# EAGLE design motorBoard (EAGLE 8.5.2)
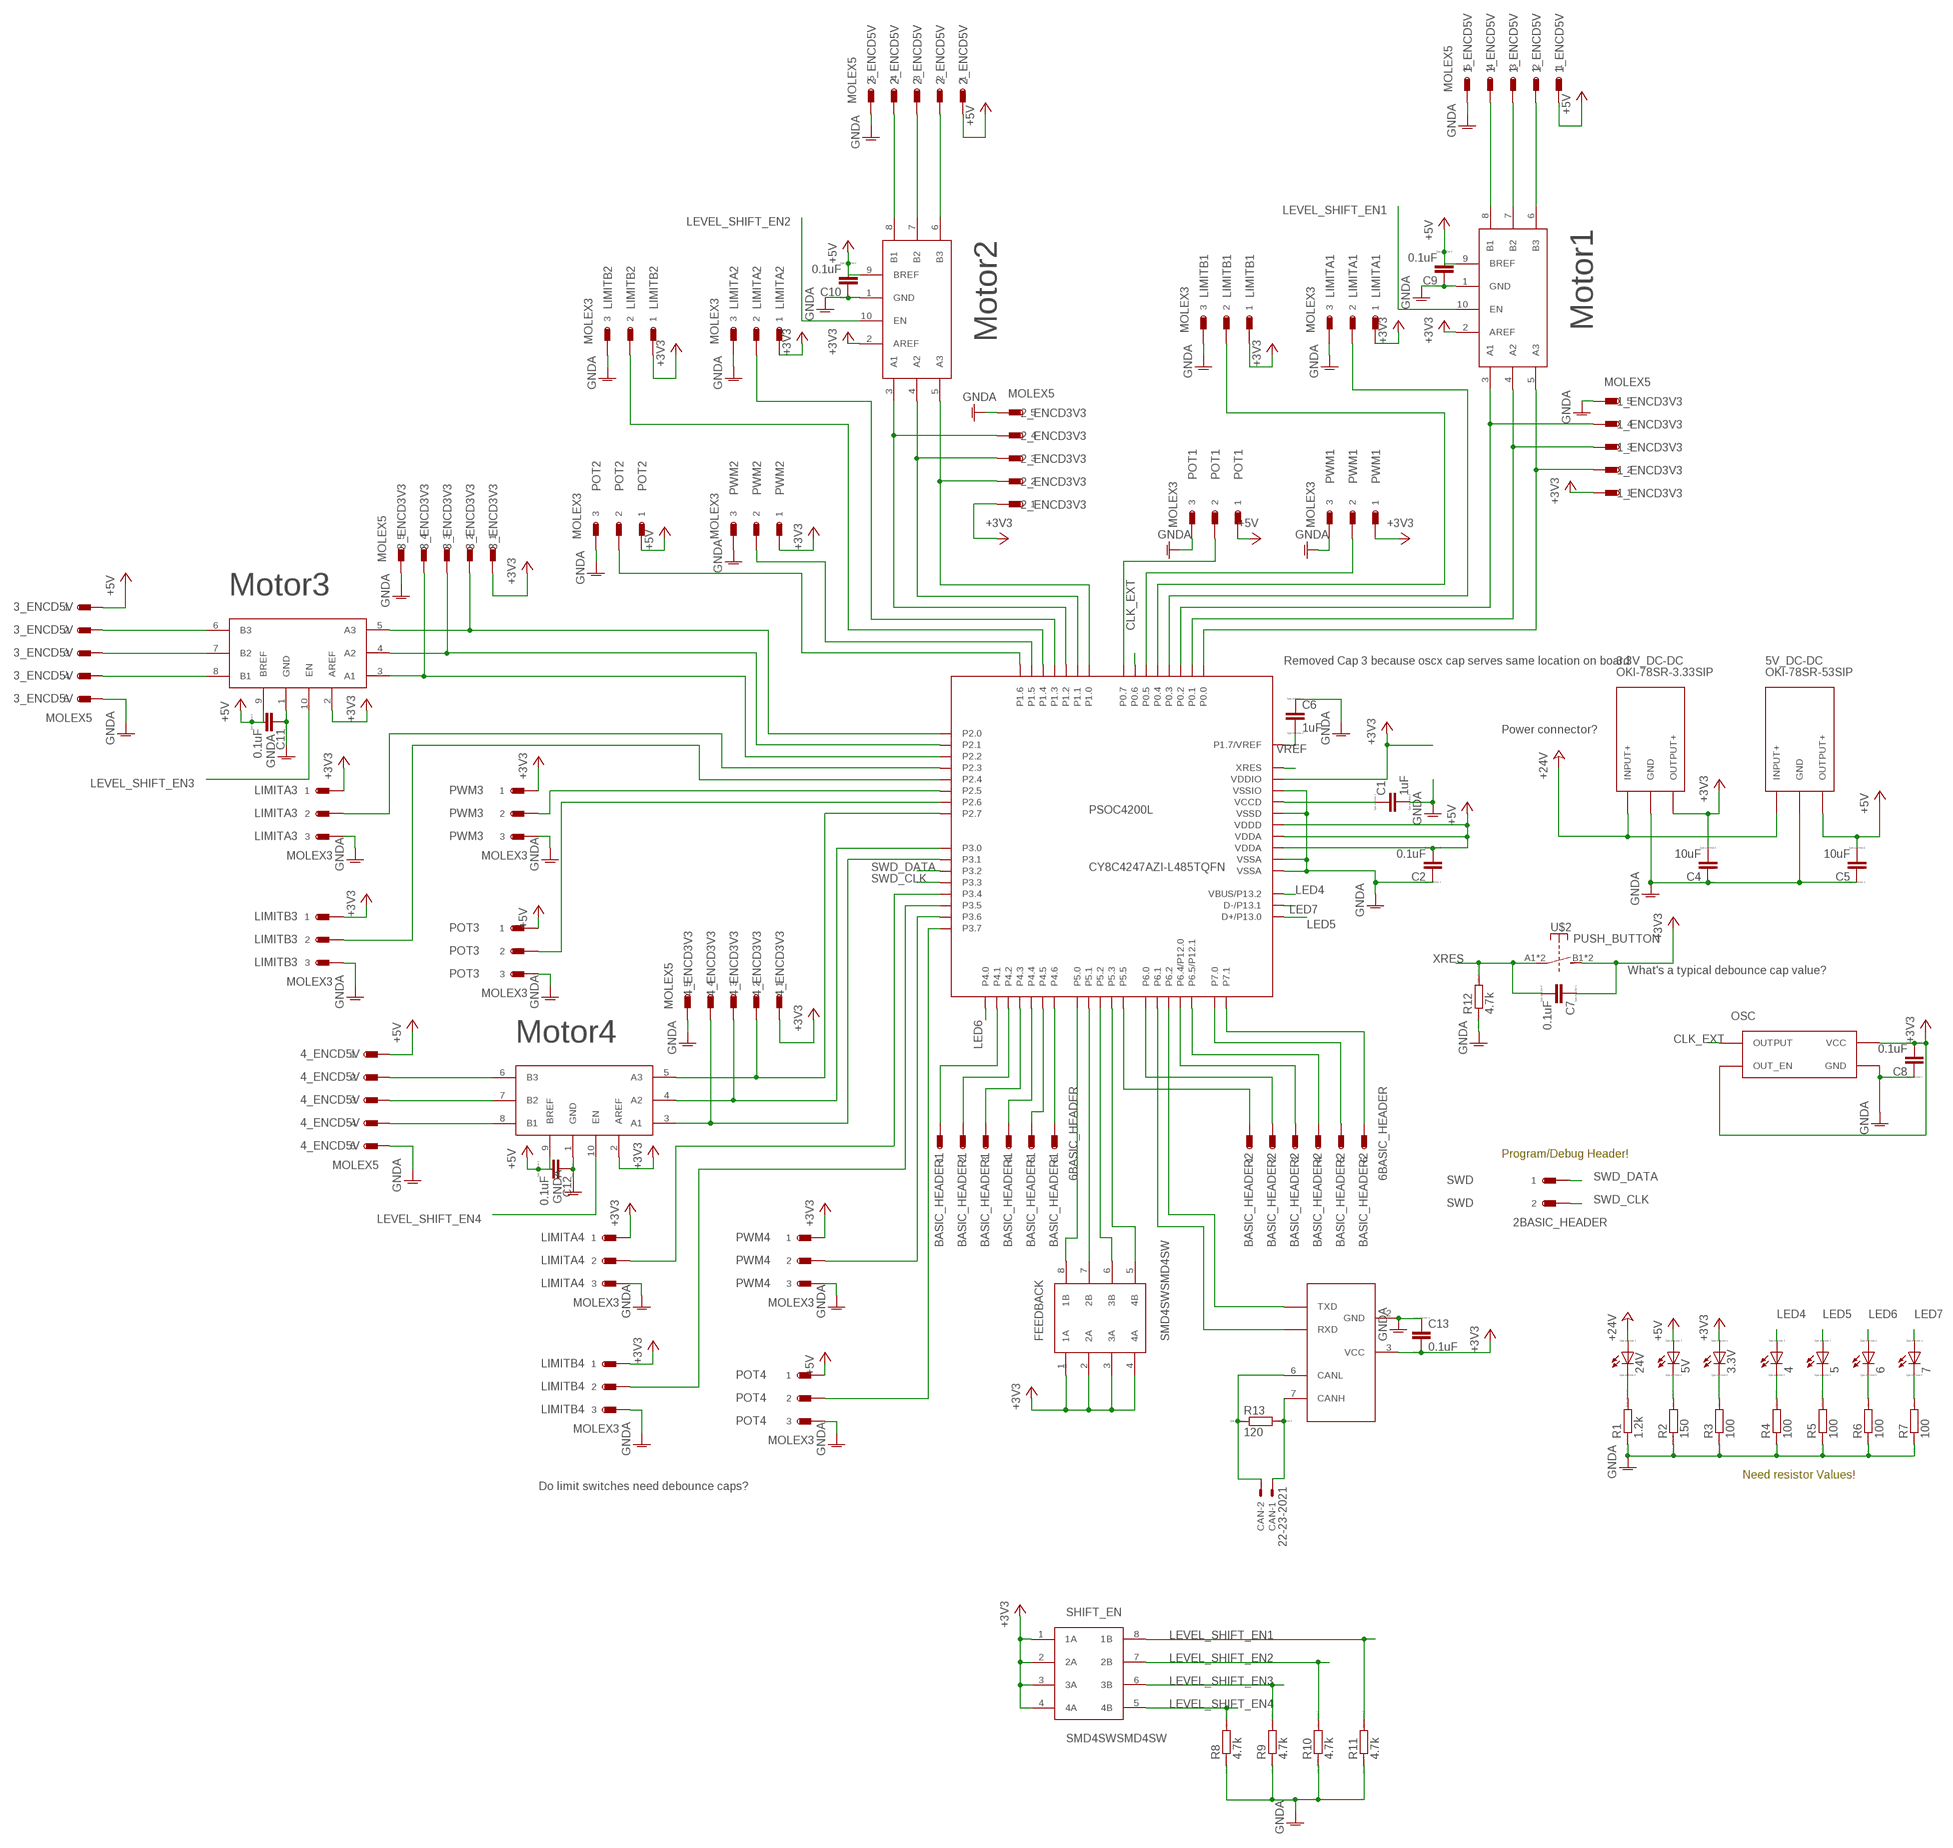
[diagram p0: schematic, sheet 1, part 1 of 2]
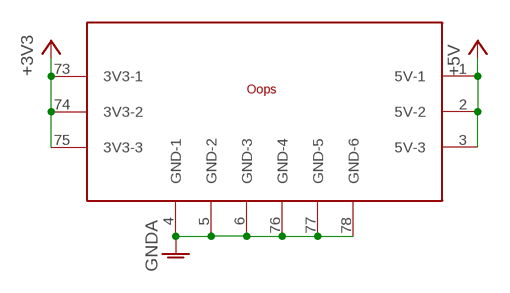
[diagram p1: schematic, sheet 1, part 2 of 2]

## Parts
1_ENCD3V3  MOLEX5  [MOLEX22-23-2051]
1_ENCD5V  MOLEX5  [MOLEX22-23-2051]
2_ENCD3V3  MOLEX5  [MOLEX22-23-2051]
2_ENCD5V  MOLEX5  [MOLEX22-23-2051]
3.3V  LED_E  [LED_1206]
3.3V_DC-DC  OKI-78SR-3.33SIP  [3SIP]
3_ENCD3V3  MOLEX5  [MOLEX22-23-2051]
3_ENCD5V  MOLEX5  [MOLEX22-23-2051]
4  LED_E  [LED_1206]
4_ENCD3V3  MOLEX5  [MOLEX22-23-2051]
4_ENCD5V  MOLEX5  [MOLEX22-23-2051]
5  LED_E  [LED_1206]
5V  LED_E  [LED_1206]
5V_DC-DC  OKI-78SR-53SIP  [3SIP]
6  LED_E  [LED_1206]
7  LED_E  [LED_1206]
24V  LED_E  [LED_1206]
BASIC_HEADER1  6BASIC_HEADER  [6SIP_HEADER]
BASIC_HEADER2  6BASIC_HEADER  [6SIP_HEADER]
C1  1uF  CC1206  [C1206]
C2  0.1uF  CC1206  [C1206]
C4  10uF  CC1206  [C1206]
C5  10uF  CC1206  [C1206]
C6  1uF  CC1206  [C1206]
C7  0.1uF  CC1206  [C1206]
C8  0.1uF  CC1206  [C1206]
C9  0.1uF  CC1206  [C1206]
C10  0.1uF  CC1206  [C1206]
C11  0.1uF  CC1206  [C1206]
C12  0.1uF  CC1206  [C1206]
C13  0.1uF  CC1206  [C1206]
CAN  22-23-2021  [22-23-2021]
FEEDBACK  SMD4SWSMD4SW  [GULL8]
LIMITA1  MOLEX3  [MOLEX22-23-2031]
LIMITA2  MOLEX3  [MOLEX22-23-2031]
LIMITA3  MOLEX3  [MOLEX22-23-2031]
LIMITA4  MOLEX3  [MOLEX22-23-2031]
LIMITB1  MOLEX3  [MOLEX22-23-2031]
LIMITB2  MOLEX3  [MOLEX22-23-2031]
LIMITB3  MOLEX3  [MOLEX22-23-2031]
LIMITB4  MOLEX3  [MOLEX22-23-2031]
OSC  ESPSON_SG-646PCE_CRYSTAL_OSCILLATOREPSON_SG-646PCE_32MHZ  [4SOJ-5.08MM]
POT1  MOLEX3  [MOLEX22-23-2031]
POT2  MOLEX3  [MOLEX22-23-2031]
POT3  MOLEX3  [MOLEX22-23-2031]
POT4  MOLEX3  [MOLEX22-23-2031]
PSOC4200L  CY8C4247AZI-L485TQFN  [TQPF64-10MM]
PWM1  MOLEX3  [MOLEX22-23-2031]
PWM2  MOLEX3  [MOLEX22-23-2031]
PWM3  MOLEX3  [MOLEX22-23-2031]
PWM4  MOLEX3  [MOLEX22-23-2031]
R1  1.2k  RR1206  [R1206]
R2  150  RR1206  [R1206]
R3  100  RR1206  [R1206]
R4  100  RR1206  [R1206]
R5  100  RR1206  [R1206]
R6  100  RR1206  [R1206]
R7  100  RR1206  [R1206]
R8  4.7k  RR1206  [R1206]
R9  4.7k  RR1206  [R1206]
R10  4.7k  RR1206  [R1206]
R11  4.7k  RR1206  [R1206]
R12  4.7k  RR1206  [R1206]
R13  120  RR1206  [R1206]
SHIFT1  LEVEL-SHIFTER_NVT2003DPNVT_2003DP_LEVEL_SHIFTER  [TSSOP10]
SHIFT2  LEVEL-SHIFTER_NVT2003DPNVT_2003DP_LEVEL_SHIFTER  [TSSOP10]
SHIFT3  LEVEL-SHIFTER_NVT2003DPNVT_2003DP_LEVEL_SHIFTER  [TSSOP10]
SHIFT4  LEVEL-SHIFTER_NVT2003DPNVT_2003DP_LEVEL_SHIFTER  [TSSOP10]
SHIFT_EN  SMD4SWSMD4SW  [GULL8]
SWD  2BASIC_HEADER  [2SIP_HEADER]
TCAN  TCAN332TCAN332  [8SOIC3.9]
U$1  OOPS_SPACE  [OOPS_SPACE]
U$2  PUSH_BUTTON  [PUSH_BUTTON]

## Nets
+3V3: 1_ENCD3V3.1 2_ENCD3V3.1 3.3V.A 3.3V_DC-DC.3(OUTPUT+) 3_ENCD3V3.1 4_ENCD3V3.1 C4.2 C7.1 C8.2 C13.2 FEEDBACK.1(1A) FEEDBACK.2(2A) FEEDBACK.3(3A) FEEDBACK.4(4A) LIMITA1.1 LIMITA2.1 LIMITA3.1 LIMITA4.1 LIMITB1.1 LIMITB2.1 LIMITB3.1 LIMITB4.1 OSC.1(OUT_EN) OSC.4(VCC) PSOC4200L.26(VDDIO) PWM1.1 PWM2.1 PWM3.1 PWM4.1 SHIFT1.2(AREF) SHIFT2.2(AREF) SHIFT3.2(AREF) SHIFT4.2(AREF) SHIFT_EN.1(1A) SHIFT_EN.2(2A) SHIFT_EN.3(3A) SHIFT_EN.4(4A) TCAN.3(VCC) U$1.73(3V3-1) U$1.74(3V3-2) U$1.75(3V3-3) U$2.B1(S) U$2.B2(S)
+5V: 1_ENCD5V.1 2_ENCD5V.1 3_ENCD5V.1 4_ENCD5V.1 5V.A 5V_DC-DC.3(OUTPUT+) C2.2 C5.2 C9.2 C10.2 C11.2 C12.2 POT1.1 POT2.1 POT3.1 POT4.1 PSOC4200L.11(VDDA) PSOC4200L.50(VDDD) PSOC4200L.56(VDDA) SHIFT1.9(BREF) SHIFT2.9(BREF) SHIFT3.9(BREF) SHIFT4.9(BREF) U$1.1(5V-1) U$1.2(5V-2) U$1.3(5V-3)
+24V: 3.3V_DC-DC.1(INPUT+) 5V_DC-DC.1(INPUT+) 24V.A
BASIC_HEADER1-1: BASIC_HEADER1.1 PSOC4200L.28(P4.1)
BASIC_HEADER1-2: BASIC_HEADER1.2 PSOC4200L.29(P4.2)
BASIC_HEADER1-3: BASIC_HEADER1.3 PSOC4200L.30(P4.3)
BASIC_HEADER1-4: BASIC_HEADER1.4 PSOC4200L.31(P4.4)
BASIC_HEADER1-5: BASIC_HEADER1.5 PSOC4200L.32(P4.5)
BASIC_HEADER1-6: BASIC_HEADER1.6 PSOC4200L.33(P4.6)
BASIC_HEADER2-1: BASIC_HEADER2.1 PSOC4200L.55(P5.5)
BASIC_HEADER2-2: BASIC_HEADER2.2 PSOC4200L.12(P6.0)
BASIC_HEADER2-3: BASIC_HEADER2.3 PSOC4200L.15(P6.4/P12.0)
BASIC_HEADER2-4: BASIC_HEADER2.4 PSOC4200L.16(P6.5/P12.1)
BASIC_HEADER2-5: BASIC_HEADER2.5 PSOC4200L.37(P7.0)
BASIC_HEADER2-6: BASIC_HEADER2.6 PSOC4200L.38(P7.1)
CANH: CAN.1 R13.2 TCAN.7(CANH)
CANL: CAN.2 R13.1 TCAN.6(CANL)
CANRX: PSOC4200L.13(P6.1) TCAN.4(RXD)
CANTX: PSOC4200L.14(P6.2) TCAN.1(TXD)
CLK_EXT: OSC.3(OUTPUT) PSOC4200L.45(P0.6)
GNDA: 1_ENCD3V3.5 1_ENCD5V.5 2_ENCD3V3.5 2_ENCD5V.5 3.3V_DC-DC.2(GND) 3_ENCD3V3.5 3_ENCD5V.5 4_ENCD3V3.5 4_ENCD5V.5 5V_DC-DC.2(GND) C1.2 C2.1 C4.1 C5.1 C6.1 C8.1 C9.1 C10.1 C11.1 C12.1 C13.1 LIMITA1.3 LIMITA2.3 LIMITA3.3 LIMITA4.3 LIMITB1.3 LIMITB2.3 LIMITB3.3 LIMITB4.3 OSC.2(GND) POT1.3 POT2.3 POT3.3 POT4.3 PSOC4200L.10(VSSA) PSOC4200L.17(VSSIO) PSOC4200L.49(VSSD) PSOC4200L.57(VSSA) PWM1.3 PWM2.3 PWM3.3 PWM4.3 R1.1 R2.1 R3.1 R4.1 R5.1 R6.1 R7.1 R8.1 R9.1 R10.1 R11.1 R12.1 SHIFT1.1(GND) SHIFT2.1(GND) SHIFT3.1(GND) SHIFT4.1(GND) TCAN.2(GND) U$1.4(GND-1) U$1.5(GND-2) U$1.6(GND-3) U$1.76(GND-4) U$1.77(GND-5) U$1.78(GND-6)
LED4: 4.A PSOC4200L.36(VBUS/P13.2)
LED5: 5.A PSOC4200L.34(D+/P13.0)
LED6: 6.A PSOC4200L.27(P4.0)
LED7: 7.A PSOC4200L.35(D-/P13.1)
LEVEL_SHIFT_EN1: R11.2 SHIFT1.10(EN) SHIFT_EN.8(1B)
LEVEL_SHIFT_EN2: R10.2 SHIFT2.10(EN) SHIFT_EN.7(2B)
LEVEL_SHIFT_EN3: R9.2 SHIFT3.10(EN) SHIFT_EN.6(3B)
LEVEL_SHIFT_EN4: R8.2 SHIFT4.10(EN) SHIFT_EN.5(4B)
MOTOR1A1: 1_ENCD3V3.4 PSOC4200L.41(P0.2) SHIFT1.3(A1)
MOTOR1A2: 1_ENCD3V3.3 PSOC4200L.40(P0.1) SHIFT1.4(A2)
MOTOR1A3: 1_ENCD3V3.2 PSOC4200L.39(P0.0) SHIFT1.5(A3)
MOTOR1B1: 1_ENCD5V.4 SHIFT1.8(B1)
MOTOR1B2: 1_ENCD5V.3 SHIFT1.7(B2)
MOTOR1B3: 1_ENCD5V.2 SHIFT1.6(B3)
MOTOR1LIMA: LIMITA1.2 PSOC4200L.42(P0.3)
MOTOR1LIMB: LIMITB1.2 PSOC4200L.43(P0.4)
MOTOR1POT: POT1.2 PSOC4200L.46(P0.7)
MOTOR1PWM: PSOC4200L.44(P0.5) PWM1.2
MOTOR2A1: 2_ENCD3V3.4 PSOC4200L.60(P1.2) SHIFT2.3(A1)
MOTOR2A2: 2_ENCD3V3.3 PSOC4200L.59(P1.1) SHIFT2.4(A2)
MOTOR2A3: 2_ENCD3V3.2 PSOC4200L.58(P1.0) SHIFT2.5(A3)
MOTOR2B1: 2_ENCD5V.4 SHIFT2.8(B1)
MOTOR2B2: 2_ENCD5V.3 SHIFT2.7(B2)
MOTOR2B3: 2_ENCD5V.2 SHIFT2.6(B3)
MOTOR2LIMA: LIMITA2.2 PSOC4200L.61(P1.3)
MOTOR2LIMB: LIMITB2.2 PSOC4200L.62(P1.4)
MOTOR2POT: POT2.2 PSOC4200L.64(P1.6)
MOTOR2PWM: PSOC4200L.63(P1.5) PWM2.2
MOTOR3A1: 3_ENCD3V3.4 PSOC4200L.4(P2.2) SHIFT3.3(A1)
MOTOR3A2: 3_ENCD3V3.3 PSOC4200L.3(P2.1) SHIFT3.4(A2)
MOTOR3A3: 3_ENCD3V3.2 PSOC4200L.2(P2.0) SHIFT3.5(A3)
MOTOR3B1: 3_ENCD5V.4 SHIFT3.8(B1)
MOTOR3B2: 3_ENCD5V.3 SHIFT3.7(B2)
MOTOR3B3: 3_ENCD5V.2 SHIFT3.6(B3)
MOTOR3LIMA: LIMITA3.2 PSOC4200L.5(P2.3)
MOTOR3LIMB: LIMITB3.2 PSOC4200L.6(P2.4)
MOTOR3POT: POT3.2 PSOC4200L.8(P2.6)
MOTOR3PWM: PSOC4200L.7(P2.5) PWM3.2
MOTOR4A1: 4_ENCD3V3.4 PSOC4200L.19(P3.1) SHIFT4.3(A1)
MOTOR4A2: 4_ENCD3V3.3 PSOC4200L.18(P3.0) SHIFT4.4(A2)
MOTOR4A3: 4_ENCD3V3.2 PSOC4200L.9(P2.7) SHIFT4.5(A3)
MOTOR4B1: 4_ENCD5V.4 SHIFT4.8(B1)
MOTOR4B2: 4_ENCD5V.3 SHIFT4.7(B2)
MOTOR4B3: 4_ENCD5V.2 SHIFT4.6(B3)
MOTOR4LIMA: LIMITA4.2 PSOC4200L.22(P3.4)
MOTOR4LIMB: LIMITB4.2 PSOC4200L.23(P3.5)
MOTOR4POT4: POT4.2 PSOC4200L.25(P3.7)
MOTOR4PWM: PSOC4200L.24(P3.6) PWM4.2
N$1: 24V.C R1.2
N$4: 5V.C R2.2
N$7: 3.3V.C R3.2
N$10: 4.C R4.2
N$13: 5.C R5.2
N$17: 6.C R6.2
N$20: 7.C R7.2
SEL_SW1: FEEDBACK.8(1B) PSOC4200L.51(P5.0)
SEL_SW2: FEEDBACK.7(2B) PSOC4200L.52(P5.1)
SEL_SW3: FEEDBACK.6(3B) PSOC4200L.53(P5.2)
SEL_SW4: FEEDBACK.5(4B) PSOC4200L.54(P5.3)
SWD_CLK: PSOC4200L.21(P3.3) SWD.2
SWD_DATA: PSOC4200L.20(P3.2) SWD.1
VCCD: C1.1 PSOC4200L.48(VCCD)
VREF: C6.2 PSOC4200L.1(P1.7/VREF)
XRES: C7.2 PSOC4200L.47(XRES) R12.2 U$2.A1(P) U$2.A2(P)

## Notes on the sheet
- Motor1
- Motor2
- Motor3
- Removed Cap 3 because oscx cap serves same location on board
- Power connector?
- What's a typical debounce cap value?
- Motor4
- Program/Debug Header!
- Need resistor Values!
- Do limit switches need debounce caps?

## Library data of the parts
1_ENCD3V3 1_ENCD5V 2_ENCD3V3 2_ENCD5V 3_ENCD3V3 3_ENCD5V 4_ENCD3V3 4_ENCD5V = HuskyRobotics2017-18:MOLEX5
3.3V 4 5 5V 6 7 24V = eagle-ltspice:LED_E: LED Source: http://www.osram.convergy.de Source: www.luxeon.com Source: www.kingbright.com; SPICEMODEL: NONE; SPICEPREFIX: D; SPICETYPE: diode
3.3V_DC-DC = HuskyRobotics2017-18:OKI-78SR-3.3: Description: This device is the Murata Power Solutions OKI-78SR DC-DC power regulator module, horizontal mount configuration. Created for Husky Robotics Team 2017-2018, part of Arm Motor Board.
5V_DC-DC = HuskyRobotics2017-18:OKI-78SR-5: Description: This device is the Murata Power Solutions OKI-78SR DC-DC power regulator module, horizontal mount configuration. Created for Husky Robotics Team 2017-2018, part of Arm Motor Board.
BASIC_HEADER1 BASIC_HEADER2 = HuskyRobotics2017-18:6BASIC_HEADER
C1 C2 C4-C13 = eagle-ltspice:C: CAPACITOR, European symbol; SPICEMODEL: NONE; SPICEPREFIX: C
CAN = con-molex:22-23-2021: .100" (2.54mm) Center Header - 2 Pin; MF: MOLEX; MPN: 22-23-2021; OC_FARNELL: 1462926; OC_NEWARK: 25C3832
FEEDBACK SHIFT_EN = HuskyRobotics2017-18:SMD4SW
LIMITA1-LIMITA4 LIMITB1-LIMITB4 POT1-POT4 PWM1-PWM4 = HuskyRobotics2017-18:MOLEX3
OSC = HuskyRobotics2017-18:ESPSON_SG-646PCE_CRYSTAL_OSCILLATOR: Description: 32MHz EPSON SG-646PCE crystal oscillator. Source. <https://support.epson.biz/td/api/doc_check.php?dl=brief_SG-636PCE_en.pdf> Created for the husky robotics team 2017-2018, arm motor board.
PSOC4200L = HuskyRobotics2017-18:CY8C4247AZI-L485: Description: This is device is a Cypress PSoC 4200-L series device in a TQFP64 (10mm) package. Created for Husky Robotics team at UW, 2017-2018 team. Contact: Dylan Tomberlin tomberln@uw.edu Know Issues: Name defaults to G$1, need help to change default name Power / IO labels may be incorrect, specifically "VDDIO", which in the online example was listed as just in, and "VSSIO".
R1-R13 = eagle-ltspice:R: RESISTOR, European symbol; SPICEMODEL: NONE; SPICEPREFIX: R
SHIFT1-SHIFT4 = HuskyRobotics2017-18:LEVEL-SHIFTER_NVT2003DP
SWD = HuskyRobotics2017-18:2BASIC_HEADER
TCAN = HuskyRobotics2017-18:TCAN332
U$1 = HuskyRobotics2017-18:OOPS_SPACE
U$2 = HuskyRobotics2017-18:PUSH_BUTTON

## Board
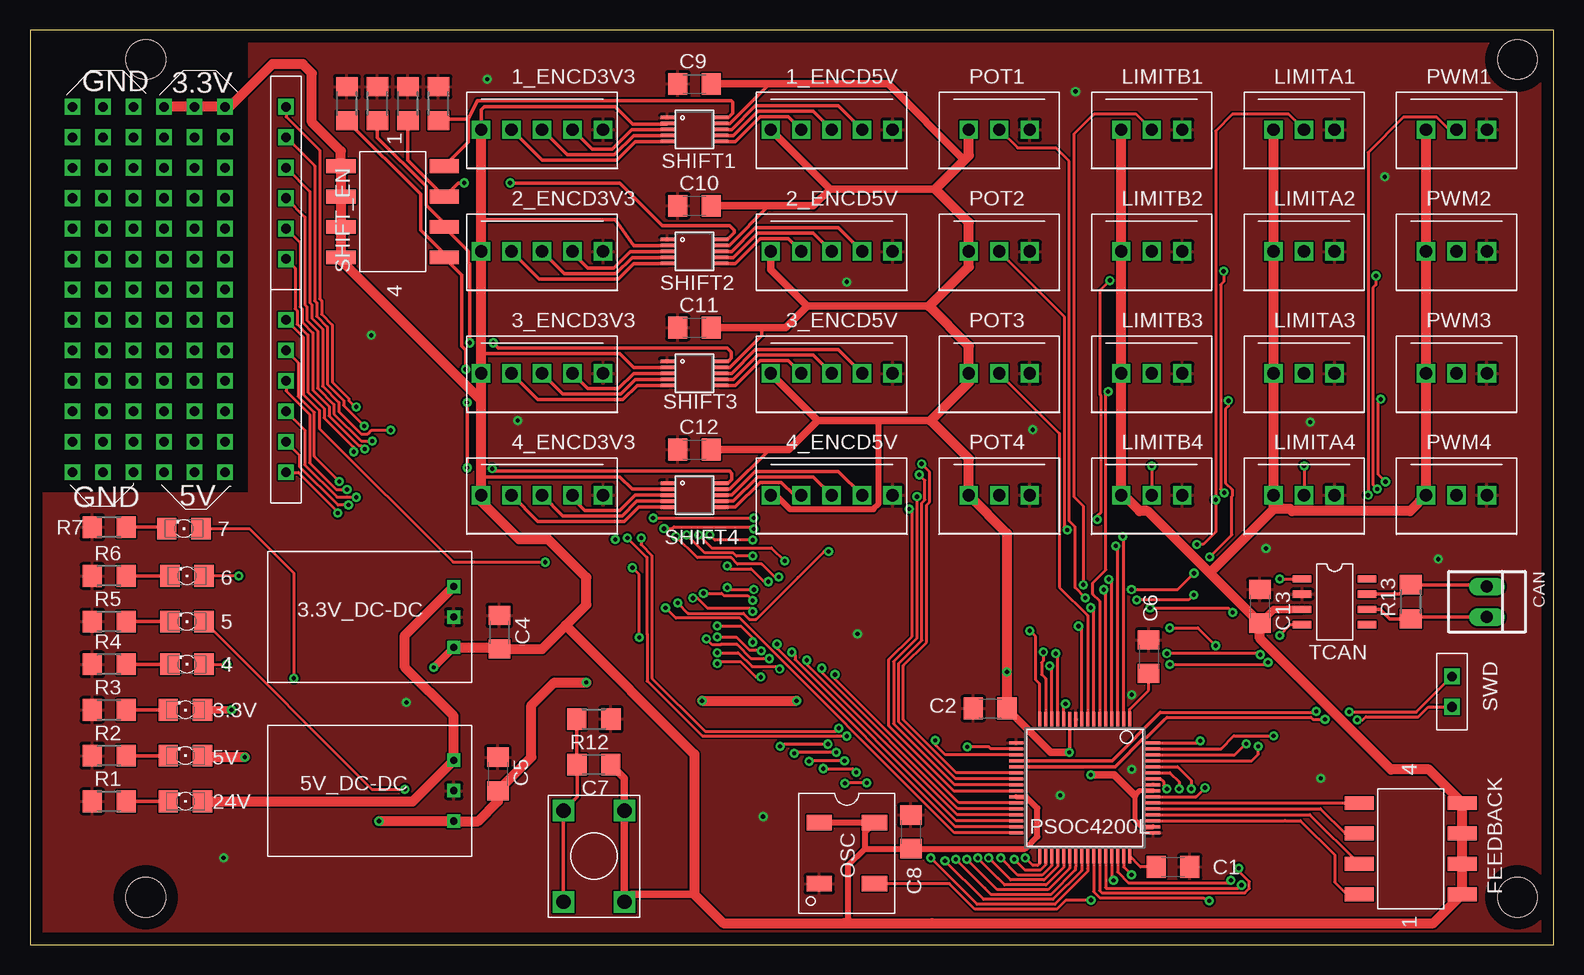
[diagram p2: board, top side]
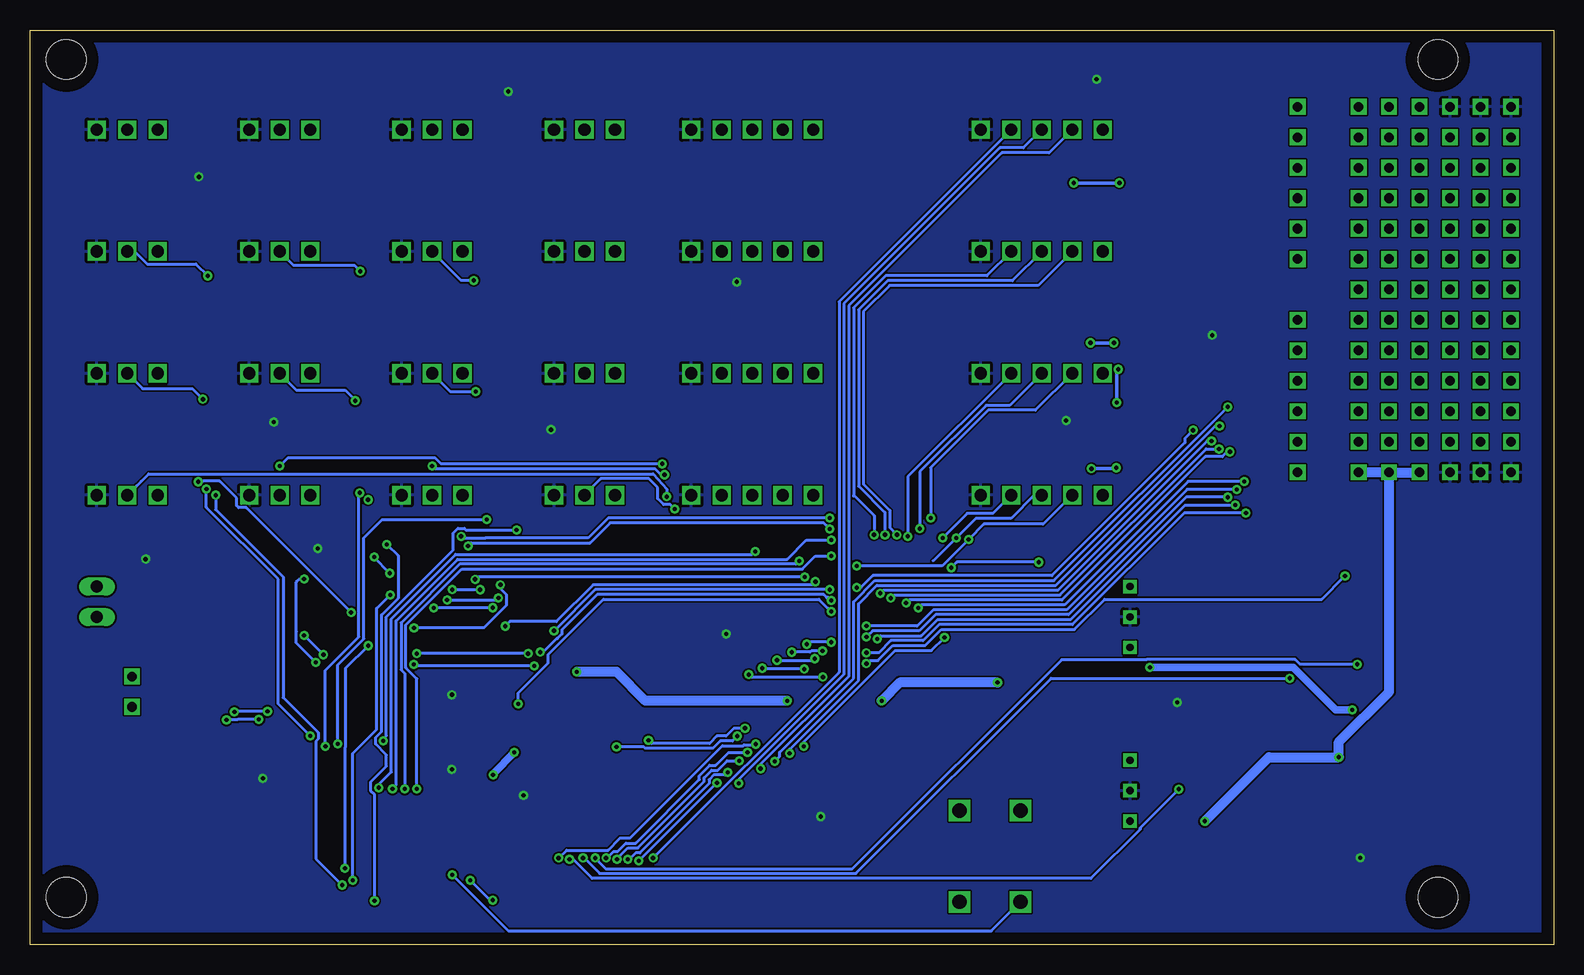
[diagram p3: board, bottom side, seen from below]

Size 126.98 x 76.25 mm. Coordinates in mm from the lower left corner, seen from the top.
Outline: 0,0 126.98,0 126.98,76.25 0,76.25 0,0
Copper layers (1*16): Top 0.035mm / dielectric 1.5mm / Bottom 0.035mm
Design rules "default": minimum track width 6mil, minimum drill 0.35mm, track to track 6mil, track to pad 6mil, pad to pad 6mil, via to via 6mil, smd to smd 6mil, copper to edge 40mil, drill to drill 6mil, minimum pad ring 10mil, minimum via ring 8mil, stop-mask expansion 4mil, vias tented up to drill 0mil, thermal gap 10mil
Holes 3.3 mm at 123.95,73.79 9.65,3.94 9.65,73.79 123.95,3.94

### Footprints (pad centres in the part's own frame; a part is rotated, then mirrored left to right if it is on the bottom)
MOLEX22-23-2051 = drill 1.016 square: 1 -5.08,0; 2 -2.54,0; 3 0,0; 4 2.54,0; 5 5.08,0
LED_1206 = smd 1.6 x 1.803: A -1.422,0; C 1.422,0
3SIP = drill 0.6 square: 1 2.54,0; 2 0,0; 3 -2.54,0
6SIP_HEADER = drill 0.795 square: 1 -6.35,0; 2 -3.81,0; 3 -1.27,0; 4 1.27,0; 5 3.81,0; 6 6.35,0
C1206 = smd 1.6 x 1.8: 1 -1.4,0; 2 1.4,0
22-23-2021 = drill 1 long: 1 -1.27,0; 2 1.27,0
GULL8 = smd 1.13 x 2.44: 1 -3.81,-4.3; 2 -1.27,-4.3; 3 1.27,-4.3; 4 3.81,-4.3; 5 3.81,4.3; 6 1.27,4.3; 7 -1.27,4.3; 8 -3.81,4.3
MOLEX22-23-2031 = drill 1.016 square: 1 -2.54,0; 2 0,0; 3 2.54,0
4SOJ-5.08MM = smd 1.3 x 2.1: 1 -2.54,-2.3; 2 2.54,-2.3; 3 2.54,2.3; 4 -2.54,2.3
TQPF64-10MM = smd 1.2 x 0.25: 1 -5.7,3.75; 2 -5.7,3.25; 3 -5.7,2.75; 4 -5.7,2.25; 5 -5.7,1.75; 6 -5.7,1.25; 7 -5.7,0.75; 8 -5.7,0.25; 9 -5.7,-0.25; 10 -5.7,-0.75; 11 -5.7,-1.25; 12 -5.7,-1.75; 13 -5.7,-2.25; 14 -5.7,-2.75; 15 -5.7,-3.25; 16 -5.7,-3.75; 33 5.7,-3.75; 34 5.7,-3.25; 35 5.7,-2.75; 36 5.7,-2.25; 37 5.7,-1.75; 38 5.7,-1.25; 39 5.7,-0.75; 40 5.7,-0.25; 41 5.7,0.25; 42 5.7,0.75; 43 5.7,1.25; 44 5.7,1.75; 45 5.7,2.25; 46 5.7,2.75; 47 5.7,3.25; 48 5.7,3.75 | smd 0.25 x 1.2: 17 -3.75,-5.7; 18 -3.25,-5.7; 19 -2.75,-5.7; 20 -2.25,-5.7; 21 -1.75,-5.7; 22 -1.25,-5.7; 23 -0.75,-5.7; 24 -0.25,-5.7; 25 0.25,-5.7; 26 0.75,-5.7; 27 1.25,-5.7; 28 1.75,-5.7; 29 2.25,-5.7; 30 2.75,-5.7; 31 3.25,-5.7; 32 3.75,-5.7; 49 3.75,5.7; 50 3.25,5.7; 51 2.75,5.7; 52 2.25,5.7; 53 1.75,5.7; 54 1.25,5.7; 55 0.75,5.7; 56 0.25,5.7; 57 -0.25,5.7; 58 -0.75,5.7; 59 -1.25,5.7; 60 -1.75,5.7; 61 -2.25,5.7; 62 -2.75,5.7; 63 -3.25,5.7; 64 -3.75,5.7
R1206 = smd 1.6 x 1.803: 1 -1.422,0; 2 1.422,0
TSSOP10 = smd 0.3 x 1.1: 1 -1,-2.25; 2 -0.5,-2.25; 3 0,-2.25; 4 0.5,-2.25; 5 1,-2.25; 6 1,2.25; 7 0.5,2.25; 8 0,2.25; 9 -0.5,2.25; 10 -1,2.25
2SIP_HEADER = drill 0.795 square: 1 -1.27,0; 2 1.27,0
8SOIC3.9 = smd 0.6 x 1.55: 1 -1.905,-2.7; 2 -0.635,-2.7; 3 0.635,-2.7; 4 1.905,-2.7; 5 1.905,2.7; 6 0.635,2.7; 7 -0.635,2.7; 8 -1.905,2.7
OOPS_SPACE = drill 0.795 square: 1 -15.24,-6.35; 2 -15.24,-3.81; 3 -15.24,-1.27; 4 -15.24,1.27; 5 -15.24,3.81; 6 -15.24,6.35; 7 -12.7,-1.27; 8 -12.7,-3.81; 9 -12.7,-6.35; 10 -12.7,1.27; 11 -12.7,3.81; 12 -12.7,6.35; 13 -10.16,-1.27; 14 -10.16,-3.81; 15 -10.16,-6.35; 16 -10.16,1.27; 17 -10.16,3.81; 18 -10.16,6.35; 19 -7.62,-1.27; 20 -7.62,-3.81; 21 -7.62,-6.35; 22 -7.62,1.27; 23 -7.62,3.81; 24 -7.62,6.35; 25 -5.08,-1.27; 26 -5.08,-3.81; 27 -5.08,-6.35; 28 -5.08,1.27; 29 -5.08,3.81; 30 -5.08,6.35; 31 -2.54,-1.27; 32 -2.54,-3.81; 33 -2.54,-6.35; 34 -2.54,1.27; 35 -2.54,3.81; 36 -2.54,6.35; 37 0,-1.27; 38 0,-3.81; 39 0,-6.35; 40 0,1.27; 41 0,3.81; 42 0,6.35; 43 2.54,-1.27; 44 2.54,-3.81; 45 2.54,-6.35; 46 2.54,1.27; 47 2.54,3.81; 48 2.54,6.35; 49 5.08,-1.27; 50 5.08,-3.81; 51 5.08,-6.35; 52 5.08,1.27; 53 5.08,3.81; 54 5.08,6.35; 55 7.62,-1.27; 56 7.62,-3.81; 57 7.62,-6.35; 58 7.62,1.27; 59 7.62,3.81; 60 7.62,6.35; 61 10.16,-1.27; 62 10.16,-3.81; 63 10.16,-6.35; 64 10.16,1.27; 65 10.16,3.81; 66 10.16,6.35; 67 12.7,-1.27; 68 12.7,-3.81; 69 12.7,-6.35; 70 12.7,1.27; 71 12.7,3.81; 72 12.7,6.35; 73 15.24,-6.35; 74 15.24,-3.81; 75 15.24,-1.27; 76 15.24,1.27; 77 15.24,3.81; 78 15.24,6.35
PUSH_BUTTON = drill 1.191 square: A1 -3.81,2.54; A2 3.81,2.54; B1 -3.81,-2.54; B2 3.81,-2.54

### Placement (x,y rotation side)
1_ENCD3V3  42.67,67.94 0 top
1_ENCD5V  66.8,67.94 0 top
2_ENCD3V3  42.67,57.78 0 top
2_ENCD5V  66.8,57.78 0 top
3.3V  12.95,19.56 180 top
3.3V_DC-DC  35.31,27.3 90 top
3_ENCD3V3  42.67,47.62 0 top
3_ENCD5V  66.8,47.62 0 top
4  13.08,23.37 180 top
4_ENCD3V3  42.67,37.47 0 top
4_ENCD5V  66.8,37.47 0 top
5  13.08,26.92 180 top
5V  12.95,15.75 180 top
5V_DC-DC  35.31,12.83 90 top
6  13.08,30.73 180 top
7  12.83,34.67 180 top
24V  12.95,11.94 180 top
BASIC_HEADER1  21.34,45.72 90 top
BASIC_HEADER2  21.34,63.5 90 top
C1  95.25,6.48 0 top
C2  80.01,19.68 0 top
C4  39.12,26.04 270 top
C5  38.99,14.22 270 top
C6  93.22,24 270 top
C7  46.99,14.99 180 top
C8  73.41,9.4 270 top
C9  55.37,71.75 0 top
C10  55.37,61.59 0 top
C11  55.37,51.44 0 top
C12  55.37,41.27 0 top
C13  102.49,28.19 270 top
CAN  121.41,28.57 270 top
FEEDBACK  115.06,8 90 top
LIMITA1  106.17,67.94 0 top
LIMITA2  106.17,57.78 0 top
LIMITA3  106.17,47.62 0 top
LIMITA4  106.17,37.47 0 top
LIMITB1  93.47,67.94 0 top
LIMITB2  93.47,57.78 0 top
LIMITB3  93.47,47.62 0 top
LIMITB4  93.47,37.47 0 top
OSC  68.07,7.62 270 top
POT1  80.77,67.94 0 top
POT2  80.77,57.78 0 top
POT3  80.77,47.62 0 top
POT4  80.77,37.47 0 top
PSOC4200L  87.88,13.08 270 top
PWM1  118.87,67.94 0 top
PWM2  118.87,57.78 0 top
PWM3  118.87,47.62 0 top
PWM4  118.87,37.47 0 top
R1  6.6,11.94 0 top
R2  6.6,15.75 0 top
R3  6.6,19.56 0 top
R4  6.6,23.37 0 top
R5  6.6,26.92 0 top
R6  6.6,30.73 0 top
R7  6.6,34.8 0 top
R8  26.42,70.1 270 top
R9  28.96,70.1 270 top
R10  31.5,70.1 270 top
R11  34.04,70.1 270 top
R12  46.99,18.8 180 top
R13  115.06,28.57 90 top
SHIFT1  55.37,67.94 270 top
SHIFT2  55.37,57.78 270 top
SHIFT3  55.37,47.62 270 top
SHIFT4  55.37,37.47 270 top
SHIFT_EN  30.23,61.09 270 top
SWD  118.49,21.08 270 top
TCAN  108.71,28.57 270 top
U$1  9.91,54.61 90 top
U$2  46.99,7.37 90 top

### Tracks (layer width: path | path; a pad name or v marks a point on that pad's centre or on a via)
+3V3  (via drill 0.35)
  Top 0.305: SHIFT2.2 50.3,58.28 48.77,60.45 37.59,60.45 | 1_ENCD3V3.1 37.59,69.6 37.85,69.85 48.77,69.85 50.22,68.4 53.08,68.4 SHIFT1.2 | 55.5,11.69 55.37,11.56 | SHIFT4.2 50.17,37.97 49.15,38.99 37.59,38.99 | SHIFT3.2 50.3,48.12 49.15,49.28 37.59,49.28
  Top 0.406: PSOC4200L.26 82.98,12.33
  Top 0.508: 67.82,1.78 68.2,2.16 68.2,6.6 69.59,8 | 69.59,8 C8.2 82.93,8 83.95,9.02 83.95,11.37 82.98,12.33 | 69.59,8 69.59,9.38 OSC.4 OSC.1
  Top 0.61: 3.3V_DC-DC.3 v33.66,23.11 | 55.37,4.19 50.16,4.19 U$2.B1 U$2.B2 49.53,13.85 C7.1 | 75.19,1.78 75.18,1.78 | v16.79,19.56 3.3V.A | C13.2 103.64,27.94 TCAN.3
  Top 0.813: 3.3V_DC-DC.3 38.99,24.77 C4.2 42.67,24.64 44.64,26.61 | 44.64,26.61 46.35,28.32 46.35,30.61 43.18,33.78 40.77,33.78 37.59,36.96 4_ENCD3V3.1 37.59,38.99 37.59,45.34 | 37.59,45.34 3_ENCD3V3.1 37.59,49.28 2_ENCD3V3.1 37.59,60.45 1_ENCD3V3.1 | 37.59,45.34 25.93,57.01 SHIFT_EN.4 SHIFT_EN.3 SHIFT_EN.2 SHIFT_EN.1 25.91,64.92 25.91,66.17 23.5,68.58 23.5,72.64 22.73,73.41 20.19,73.41 16.64,69.85 U$1.73 U$1.74 U$1.75 | 44.64,26.61 55.37,15.88 55.37,11.56 55.37,4.19 57.78,1.78 67.82,1.78 75.18,1.78 116.95,1.78 FEEDBACK.1 FEEDBACK.2 FEEDBACK.3 FEEDBACK.4 116.57,14.61 113.41,14.61 102.49,25.53 C13.2 98.3,30.99 | 98.3,30.99 93.14,36.14 92.48,36.14 91.16,37.47 LIMITB4.1 LIMITB3.1 LIMITB2.1 LIMITB1.1 | 98.3,30.99 103.63,36.32 | 103.63,36.32 LIMITA4.1 LIMITA3.1 LIMITA2.1 LIMITA1.1 | PWM1.1 PWM2.1 PWM3.1 PWM4.1 115.01,36.14 105.18,36.14 105,36.32 103.63,36.32
  Bottom 0.61: v33.66,23.11 21.72,23.11 18.16,19.56 v16.79,19.56
+5V  (via drill 0.35)
  Top 0.305: 61.85,61.59 61.56,61.59 58.25,58.28 SHIFT2.9 | 61.56,51.44 61.72,51.44 | PSOC4200L.56 | SHIFT1.9 58.33,68.44 61.59,71.71 61.59,71.75 | SHIFT3.9 58.33,48.12 60.96,50.76 60.96,51.44 | SHIFT4.9 58.33,37.97 61.59,41.23 61.59,41.27 | PSOC4200L.11 86.63,16.03 v86.61,16.01
  Top 0.406: PSOC4200L.56 92.46,12.83 92.08,12.45 92.08,10.41 92.66,9.83 PSOC4200L.50
  Top 0.508: 4_ENCD5V.1 62.16,37.47 63.33,36.3 70.27,36.3 70.71,36.74 70.71,43.66 70.74,43.69
  Top 0.61: 38.99,11.94 C5.2 | 14.5,15.62 5V.A | 75.06,43.69 70.74,43.69 65.66,43.69 | 65.66,43.69 3_ENCD5V.1 | 65.66,43.69 63.25,41.27 61.59,41.27 C12.2 | C11.2 60.96,51.44 61.72,51.44 62.99,51.44 64.77,53.21 | 64.77,53.21 74.93,53.21 | 2_ENCD5V.1 61.72,56.26 64.77,53.21 | 1_ENCD5V.1 66.67,62.99 | 66.67,62.99 75.44,62.99 | 66.67,62.99 65.28,61.59 61.85,61.59 C10.2 | 77.85,65.41 71.5,71.75 61.59,71.75 C9.2 | C2.2 85.08,16.01 v86.61,16.01 | v88.39,14.15 90.37,14.15 92.08,12.45
  Top 0.813: 38.99,11.94 37.34,10.29 5V_DC-DC.3 v29.08,10.29 | v17.91,15.62 14.5,15.62 | POT1.1 78.23,65.79 77.85,65.41 75.44,62.99 78.23,60.2 POT2.1 78.23,56.52 74.93,53.21 78.23,49.91 POT3.1 78.23,46.86 75.06,43.69 78.23,40.51 POT4.1 81.41,34.29 v81.41,22.73 C2.2 | C5.2 41.78,15.62 41.78,19.94 43.69,21.84 v46.35,21.84 | v56.01,20.32 v63.88,20.32
  Bottom 0.61: v86.61,16.01 88.39,14.24 v88.39,14.15
  Bottom 0.813: v29.08,10.29 23.75,15.62 v17.91,15.62 17.91,16.89 13.72,21.08 U$1.2 | U$1.2 U$1.1 | U$1.2 U$1.3 | v46.35,21.84 54.48,21.84 v56.01,20.32 | v63.88,20.32 75.69,20.32 78.11,22.73 v81.41,22.73
+24V
  Top 0.813: 24V.A 31.88,11.94 5V_DC-DC.1 35.31,19.05 31.24,23.11 31.24,25.78 3.3V_DC-DC.1
BASIC_HEADER1-1  (via drill 0.35)
  Top 0.254: PSOC4200L.28 77.33,11.33 65.97,22.69 v65.97,23.04 | BASIC_HEADER1.1 22.36,39.37 25.65,36.08 v25.65,35.98 | v57.28,24.33 59.02,24.33 60.17,23.18 62.26,23.18 v62.46,22.97
  Bottom 0.254: v25.65,35.98 30.81,35.98 40.12,26.67 51.21,26.67 52.54,25.34 55.24,25.34 56.25,24.33 v57.28,24.33 | v62.46,22.97 65.89,22.97 v65.97,23.04
BASIC_HEADER1-2  (via drill 0.35)
  Top 0.254: PSOC4200L.29 77.25,10.83 64.73,23.35 v64.73,23.71 | BASIC_HEADER1.2 22.48,40.77 22.48,39.83 25.67,36.63 v26.54,36.63 | v61.59,23.83 60.09,23.83 58.92,25.01 57.57,25.01 57.55,24.99 56.87,24.99 v56.37,25.49
  Bottom 0.254: v64.73,23.71 61.72,23.71 v61.59,23.83 | v56.37,25.49 56.12,25.74 52.71,25.74 51.35,27.1 40.26,27.1 30.73,36.63 v26.54,36.63
BASIC_HEADER1-3  (via drill 0.35)
  Top 0.254: PSOC4200L.30 77.18,10.33 63.75,23.75 63.75,24.11 v63.49,24.37 | BASIC_HEADER1.3 22.89,42.9 22.89,40 25.59,37.29 v27.18,37.29 | v60.94,24.49 60.88,24.55 59.95,24.55 58.85,25.64 v57.28,25.64
  Bottom 0.254: v27.18,37.29 30.65,37.29 40.43,27.51 51.52,27.51 52.88,26.15 56.76,26.15 57.01,25.9 57.03,25.9 v57.28,25.64 | v60.94,24.49 61.87,24.49 61.98,24.38 63.48,24.38 v63.49,24.37
BASIC_HEADER1-4  (via drill 0.35)
  Top 0.254: PSOC4200L.31 77.1,9.83 62.25,24.68 v62.25,25.04 | BASIC_HEADER1.4 21.34,46.15 23.29,44.19 23.29,40.17 25.51,37.95 v26.42,37.95 | v57.28,26.55 59.23,26.55 60.22,25.57 v60.22,25.21
  Bottom 0.254: v26.42,37.95 30.56,37.95 40.6,27.91 51.69,27.91 53.05,26.55 v57.28,26.55 | v60.22,25.21 62.08,25.21 v62.25,25.04
BASIC_HEADER1-5  (via drill 0.35)
  Top 0.254: PSOC4200L.32 77.03,9.33 59.15,27.21 53.82,27.21 v52.96,28.07 | BASIC_HEADER1.5 22.35,48.51 22.35,45.71 23.7,44.36 23.7,40.69 v25.78,38.61
  Bottom 0.254: v25.78,38.61 30.48,38.61 40.77,28.32 52.71,28.32 v52.96,28.07
BASIC_HEADER1-6  (via drill 0.35)
  Top 0.254: PSOC4200L.33 84.13,6.79 83.95,6.6 83.57,6.6 82.96,7.21 v82.93,7.21 | BASIC_HEADER1.6 22.76,50.65 22.76,45.88 24.11,44.53 24.11,43.03 35.26,31.88 v42.93,31.88 | v66.49,16.71 62.68,16.71 v62.51,16.53 | v50.77,25.61 50.77,30.85 v50.2,31.42
  Bottom 0.254: v82.93,7.21 82.27,7.87 78.81,7.87 77.82,8.86 76.99,8.86 69.28,16.57 67.56,16.57 67.46,16.67 66.53,16.67 v66.49,16.71 | v62.51,16.53 62.51,16.89 54.89,24.51 51.86,24.51 v50.77,25.61 | v42.93,31.88 49.74,31.88 v50.2,31.42
BASIC_HEADER2-1  (via drill 0.35)
  Top 0.254: BASIC_HEADER2.1 22.1,56.39 22.1,53.01 22.27,52.84 22.27,51.71 23.16,50.82 23.16,46.04 24.51,44.7 24.51,43.91 26.98,41.44 v26.98,41.09 | v53.98,28.48 54.83,27.62 59.45,27.62 59.95,27.12 60.51,27.12 64.01,30.61 66.18,32.78 v66.55,32.78 | PSOC4200L.55 97.17,12.33 v97.92,13.08
  Bottom 0.254: v26.98,41.09 27.2,41.09 27.62,40.67 29.04,40.67 40.98,28.73 53.72,28.73 v53.97,28.48 v53.98,28.48 | v97.92,13.08 97.92,13.34 96.87,14.38 96.87,27.16 91.5,32.53 66.8,32.53 v66.55,32.78
BASIC_HEADER2-2  (via drill 0.35)
  Top 0.254: BASIC_HEADER2.2 22.5,58.52 22.5,53.17 22.67,53.01 22.67,51.88 23.57,50.98 23.57,46.21 24.92,44.87 24.92,44.08 27.42,41.58 27.64,41.58 v27.89,41.33 | PSOC4200L.12 86.13,19.97 86.23,20.07 v86.29,20.07 | v60.22,27.77 59.97,28.02 56.46,28.02 55.6,28.88 v55.24,28.88
  Bottom 0.254: v86.29,20.07 86.29,20.98 83.8,23.48 83.8,24.17 79.19,28.78 61.25,28.78 60.49,28.02 60.47,28.02 v60.22,27.77 | v55.24,28.88 54.99,29.13 41.15,29.13 28.96,41.33 v27.89,41.33
BASIC_HEADER2-3  (via drill 0.35)
  Top 0.254: PSOC4200L.15 84.63,22.17 84.31,22.5 84.31,23.51 84.45,23.66 v84.45,24.38 | BASIC_HEADER2.3 22.91,60.66 22.91,53.34 23.08,53.17 23.08,52.05 23.98,51.15 23.98,46.38 25.32,45.03 25.32,44.25 27.59,41.98 v28.52,41.98 | v56.12,29.29 57.63,29.29 57.82,29.1 59.8,29.1 v60.22,28.68
  Bottom 0.254: v28.52,41.98 28.88,41.98 41.32,29.54 55.87,29.54 v56.12,29.29 | v60.22,28.68 60.47,28.93 60.6,28.93 60.85,29.18 79.72,29.18 82.65,26.25 82.65,25.89 83.04,25.5 83.08,25.5 84.2,24.38 v84.45,24.38
BASIC_HEADER2-4  (via drill 0.35)
  Top 0.254: BASIC_HEADER2.4 23.32,62.79 23.32,53.51 23.49,53.34 23.49,52.22 24.38,51.32 24.38,46.55 25.73,45.2 25.73,44.42 27.58,42.56 28.13,42.56 28.45,42.88 v30.06,42.88 | v58.09,29.76 58.26,29.59 v60.33,29.59 | v83.31,26.16 83.8,25.68 83.8,22.08 84.13,21.74 PSOC4200L.16
  Bottom 0.254: v30.06,42.88 30.73,42.2 30.73,41.85 41.82,30.76 56.73,30.76 57.74,29.76 v58.09,29.76 | v60.33,29.59 79.88,29.59 v83.31,26.16
BASIC_HEADER2-5  (via drill 0.35)
  Top 0.254: PSOC4200L.37 86.13,6.43 84.68,4.98 81.21,4.98 80.64,5.55 80.61,5.55 79.22,6.94 79.22,6.96 v78.97,7.21 | BASIC_HEADER2.5 23.72,64.92 23.72,53.68 23.89,53.51 23.89,52.39 24.79,51.49 24.79,46.72 26.14,45.37 26.14,44.94 v27.86,43.22 | v67.19,16.01 63.76,16.01 v63.68,15.93
  Bottom 0.254: v78.97,7.21 78.89,7.21 78.34,7.77 78,7.77 77.32,8.46 76.5,8.46 71.2,13.76 71.2,14.08 70.34,14.94 69.84,14.94 68.77,16.01 v67.19,16.01 | v63.68,15.93 63.68,16.29 57.94,22.03 57.94,28.41 56.4,29.95 41.49,29.95 28.21,43.22 v27.86,43.22
BASIC_HEADER2-6  (via drill 0.35)
  Top 0.254: PSOC4200L.38 86.63,6.36 84.85,4.57 80.61,4.57 v78.06,7.11 | BASIC_HEADER2.6 21.34,69.01 24.13,66.21 24.13,53.85 24.3,53.68 24.3,52.56 25.2,51.66 25.2,46.88 26.57,45.51 26.57,45.34 27.08,44.83 v27.18,44.83 | v67.88,15.32 64.98,15.32 v64.92,15.27
  Bottom 0.254: v78.06,7.11 77.81,7.36 77.81,7.38 77.15,8.05 76.33,8.05 70.8,13.59 70.8,13.91 70.17,14.53 69.67,14.53 68.88,15.32 v67.88,15.32 | v64.92,15.27 64.52,15.68 64.52,16.03 58.34,22.2 58.34,28.57 56.57,30.35 41.66,30.35 v27.18,44.83
CANH
  Top 0.305: TCAN.7 114.28,29.21 R13.2 121.26,30 CAN.1
CANL
  Top 0.305: CAN.2 115.21,27.3 R13.1 113.31,27.15 112.52,27.94 TCAN.6
CANRX  (via drill 0.35)
  Top 0.254: PSOC4200L.13 85.63,24.1 v85.48,24.26 | v104.14,25.78 105.03,26.67 TCAN.4 | v94.74,24.26 102.43,24.26 v102.53,24.17
  Bottom 0.254: v104.14,25.78 102.74,24.38 102.62,24.26 v102.53,24.17 | v85.48,24.26 v94.74,24.26
CANTX  (via drill 0.35)
  Top 0.254: PSOC4200L.14 85.13,23.07 v84.96,23.24 | v95,23.35 102.99,23.35 v103.17,23.52 | 105.03,30.48 TCAN.1 v104.14,30.48
  Bottom 0.254: v84.96,23.24 94.89,23.24 v95,23.35 | v103.17,23.52 104.8,25.15 104.8,26.05 104.78,26.08 104.78,30.23 104.52,30.48 v104.14,30.48
CLK_EXT  (via drill 0.35)
  Top 0.254: PSOC4200L.45 90.13,5.52 v90.29,5.37 | v88.41,3.71 86.33,3.71 85.57,2.95 78.75,2.95 76.62,5.08 OSC.3
  Bottom 0.254: v90.29,5.37 88.63,3.71 v88.41,3.71
GNDA  (via drill 0.35)
  other vias: 16.13,7.24 31.37,20.19 61.09,10.67 68.96,25.91 85.85,12.45 107.57,13.84 117.35,32.13 103,33.02 106.68,43.56 83.57,42.93 40.64,43.69 28.45,50.8 68.07,55.24 87.12,71.12 38.1,72.14 112.9,64.01 91.82,14.61 91.82,20.83
  pour Top: -0.13,-0.13 127.13,-0.13 127.13,76.33 18.29,76.33 18.29,37.59 -0.13,37.59
  pour Bottom: -0.13,-0.13 127.13,-0.13 127.13,76.33 -0.13,76.33
LED4  (via drill 0.35)
  Top 0.254: PSOC4200L.36 85.63,6.51 84.51,5.38 81.71,5.38 v79.88,7.21 | 4.A v16.38,23.37
  Bottom 0.254: v79.88,7.21 79.63,6.96 79.63,6.94 79.02,6.33 58.44,6.33 41.02,23.75 33.95,23.75 33.93,23.77 21.55,23.77 21.14,23.37 v16.38,23.37
LED5  (via drill 0.35)
  Top 0.254: PSOC4200L.34 84.63,6.66 84.18,6.2 82.94,6.2 v82.02,7.11 | 5.A 28.47,12.95 v31.24,12.95
  Bottom 0.254: v31.24,12.95 34.47,9.72 34.47,9.62 38.58,5.51 80.13,5.51 81.73,7.11 v82.02,7.11
LED6  (via drill 0.35)
  Top 0.254: PSOC4200L.27 77.4,11.83 67.08,22.15 v67.08,22.51 | v60.9,22.3 60.48,22.3 59.23,23.54 57.4,23.54 v57.28,23.42 | v17.4,30.73 6.A
  Bottom 0.254: v67.08,22.51 66.87,22.3 v60.9,22.3 | v57.28,23.42 57.03,23.67 56.33,23.67 55.08,24.93 52.38,24.93 51.04,26.26 39.95,26.26 37.42,28.79 19.34,28.79 v17.4,30.73
LED7  (via drill 0.35)
  Top 0.254: PSOC4200L.35 85.13,6.58 84.34,5.79 82.32,5.79 v80.9,7.21 | 7.A 18.29,34.67 21.99,30.97 v21.99,22.21
  Bottom 0.254: v80.9,7.21 80.81,7.21 79.52,5.92 58.15,5.92 41.88,22.19 22,22.19 v21.99,22.21
LEVEL_SHIFT_EN1
  Top 0.305: SHIFT_EN.8 36.52,66.9 36.52,68.83 | 36.52,68.83 37.29,70.36 56.26,70.36 58.42,70.36 58.56,70.22 58.56,69.33 58.18,68.94 SHIFT1.10 | 36.52,68.83 34.19,68.83 R11.2
LEVEL_SHIFT_EN2  (via drill 0.35)
  Top 0.305: v36.2,63.5 35.67,63.5 SHIFT_EN.7 31.5,65.39 R10.2 | v40.01,63.5 49.15,63.5 52.7,59.94 58.29,59.94 58.67,59.56 58.67,59.35 58.11,58.78 SHIFT2.10
  Bottom 0.305: v36.2,63.5 v40.01,63.5
LEVEL_SHIFT_EN3  (via drill 0.35)
  Top 0.305: R9.2 28.96,67.28 33,63.23 33,61.67 34.53,60.14 SHIFT_EN.6 36.52,57.82 36.52,56.9 36.66,56.77 v36.66,50.16 | SHIFT3.10 58.18,48.62 58.44,48.88 58.44,49.39 58.09,49.73 39.04,49.73 v38.61,50.16
  Bottom 0.305: v38.61,50.16 v36.66,50.16
LEVEL_SHIFT_EN4  (via drill 0.35)
  Top 0.305: R8.2 32.54,62.55 32.54,59.58 34.53,57.6 SHIFT_EN.5 35.97,55.83 35.97,49.88 36.3,49.55 v36.3,47.96 | SHIFT4.10 58.18,38.47 58.5,38.78 58.5,39.29 58.29,39.5 38.7,39.5 v38.53,39.67 | v36.45,39.75 36.45,45.16 v36.42,45.18
  Bottom 0.305: v38.53,39.67 36.53,39.67 v36.45,39.75 | v36.42,45.18 36.42,47.84 v36.3,47.96
MOTOR1A1  (via drill 0.35)
  Top 0.254: PSOC4200L.41 88.13,6.35 88.14,6.35 88.14,6.09 85.4,3.35 78.92,3.35 v75.06,7.21
  Top 0.305: SHIFT1.3 50.16,67.94 48.51,66.29 46.86,66.29 1_ENCD3V3.4
  Bottom 0.254: 1_ENCD3V3.4 59.56,53.59 59.56,22.71 v75.06,7.21
MOTOR1A2  (via drill 0.35)
  Top 0.254: PSOC4200L.40 87.63,6.16 85.23,3.76 79.47,3.76 v76.25,6.99 | v69.73,13.47 67.95,13.47 v67.91,13.43
  Top 0.305: SHIFT1.4 50.31,67.44 48.7,65.84 44.78,65.84 1_ENCD3V3.3
  Bottom 0.254: 1_ENCD3V3.3 44.2,66.42 46.16,66.42 59.16,53.43 59.16,22.54 67.91,13.78 v67.91,13.43 | v76.25,6.99 69.76,13.47 v69.73,13.47
MOTOR1A3  (via drill 0.35)
  Top 0.254: PSOC4200L.39 87.13,6.49 87.12,6.48 87.12,6.22 85.06,4.17 80.1,4.17 79.57,4.7 79.55,4.7 77.41,6.84 77.41,6.86 v77.16,7.11 | v66.1,14.66 68.53,14.66 v68.84,14.36
  Top 0.305: SHIFT1.5 50.46,66.94 48.89,65.38 42.7,65.38 1_ENCD3V3.2
  Bottom 0.254: 1_ENCD3V3.2 42.06,66.02 45.99,66.02 58.75,53.26 58.75,36.2 58.75,36.03 58.75,22.37 66.28,14.84 v66.1,14.66 | v68.84,14.36 69.07,14.13 70,14.13 70.39,13.74 70.39,13.42 76.17,7.64 76.52,7.64 77.05,7.11 v77.16,7.11
MOTOR1B1
  Top 0.305: SHIFT1.8 58.47,67.94 60.45,69.93 67.36,69.93 1_ENCD5V.4
MOTOR1B2
  Top 0.305: SHIFT1.7 58.62,67.44 60.64,69.47 65.28,69.47 1_ENCD5V.3
MOTOR1B3
  Top 0.305: SHIFT1.6 58.77,66.94 60.83,69.01 63.2,69.01 1_ENCD5V.2
MOTOR1LIMA  (via drill 0.35)
  Top 0.254: PSOC4200L.42 88.63,4.41 89.15,3.89 97.77,3.89 v98.27,3.64 | LIMITA1.2 104.9,69.22 100.2,69.22 98.81,67.82 v98.81,37.08 98.81,34.42 97.75,33.36 v97.25,33.36
  Bottom 0.254: v98.27,3.64 98.27,12.51 98.58,12.81 98.58,13.57 97.28,14.86 97.28,15.81 98.19,16.72 98.19,17.26 97.69,17.76 97.69,27.5 96.31,28.88 96.31,32.43 v97.25,33.36
MOTOR1LIMB  (via drill 0.35)
  Top 0.254: PSOC4200L.43 89.13,4.49 89.32,4.3 101.23,4.3 101.62,4.69 101.62,5.23 100.73,6.11 v100.73,6.35 | LIMITB1.2 92.2,69.22 88.65,69.22 87,67.56 87,37.34 87.76,36.58 87.76,29.97 v87.78,30 | v94.98,26.4 97.32,26.4 v98.8,24.91
  Bottom 0.254: v87.78,30 87.78,29.67 87.28,29.18 87.28,28.27 89.16,26.4 v94.98,26.4 | v100.73,6.35 100.73,16.42 100.69,16.47 100.69,23.03 v98.8,24.91
MOTOR1POT  (via drill 0.35)
  Top 0.254: PSOC4200L.46 90.63,6.05 91.57,5.11 99.83,5.11 v100.08,5.37 | POT1.2 82.3,66.42 85.47,66.42 86.59,65.3 86.59,35.33 87.09,34.83 87.09,29.75 v87.94,28.9 | v96.97,29.15 96.56,28.74 v92.23,28.74
  Bottom 0.254: v100.08,5.37 100.08,15.95 98.09,17.93 98.09,28.02 v96.97,29.15 | v92.23,28.74 88.11,28.74 v87.94,28.9
MOTOR1PWM  (via drill 0.35)
  Top 0.254: PSOC4200L.44 89.63,4.74 89.66,4.71 100.71,4.71 v100.96,4.96 | PWM1.2 118.25,67.94 117.21,68.99 114.45,68.99 111.51,66.04 v111.51,37.47
  Bottom 0.254: v111.51,37.47 111.51,36.26 105.89,30.65 105.89,20.59 102.97,17.67 102.97,17.13 103.17,16.93 103.17,7.17 v100.96,4.96
MOTOR2A1  (via drill 0.35)
  Top 0.254: PSOC4200L.60 95.63,14.83 96.77,13.69 v96.77,12.99 | v60.22,33.73 57.08,33.73 v56.64,34.16
  Top 0.305: SHIFT2.3 50.04,57.78 48.64,56.39 46.48,56.39 45.21,57.66 2_ENCD3V3.4
  Bottom 0.254: 2_ENCD3V3.4 47.24,55.75 55.68,55.75 58.34,53.09 58.34,37.47 | 58.34,37.47 58.34,37.36 | 58.34,37.47 56.64,35.76 v56.64,34.16 | v96.77,12.99 96.47,13.3 96.47,27 91.34,32.12 63.88,32.12 62.28,33.73 v60.22,33.73
MOTOR2A2  (via drill 0.35)
  Top 0.254: PSOC4200L.59 95,14.33 95.76,13.57 v95.76,12.99 | v55.73,34.16 55.98,33.91 55.98,33.89 56.8,33.07 61.78,33.07 v62.88,31.97
  Top 0.305: SHIFT2.4 50.19,57.28 48.83,55.93 44.53,55.93 2_ENCD3V3.3
  Bottom 0.254: 2_ENCD3V3.3 45.11,55.35 55.51,55.35 57.94,52.92 57.94,38.23 55.73,36.02 v55.73,34.16 | v62.88,31.97 63.13,31.72 91.17,31.72 96.06,26.83 96.06,22.91 95.76,22.61 v95.76,12.99
MOTOR2A3  (via drill 0.35)
  Top 0.254: v94.74,12.99 94.46,13.27 94.46,13.57 94.2,13.83 PSOC4200L.58 | v60.22,32.39 58.87,32.39 58.59,32.66 56.24,32.66 v54.74,34.16
  Top 0.305: SHIFT2.5 50.33,56.78 49.02,55.47 42.44,55.47 2_ENCD3V3.2
  Bottom 0.254: 2_ENCD3V3.2 42.98,54.94 55.34,54.94 57.53,52.75 57.53,38.4 55.33,36.19 55.33,34.75 v54.74,34.16 | v94.74,12.99 94.74,22.16 95.65,23.08 95.65,26.66 91,31.31 62.61,31.31 61.54,32.39 v60.22,32.39
MOTOR2B1
  Top 0.305: SHIFT2.8 58.47,57.78 60.45,59.77 67.36,59.77 2_ENCD5V.4
MOTOR2B2
  Top 0.305: SHIFT2.7 58.62,57.28 60.64,59.31 65.28,59.31 2_ENCD5V.3
MOTOR2B3
  Top 0.305: SHIFT2.6 58.77,56.78 60.83,58.85 63.2,58.85 2_ENCD5V.2
MOTOR2LIMA  (via drill 0.35)
  Top 0.254: PSOC4200L.61 101.82,15.33 102.36,15.88 v102.36,16.51 | v99.46,56.13 99.46,55.27 99.21,55.02 99.21,37.96 v99.51,37.66
  Bottom 0.254: LIMITA2.2 105.03,56.64 99.95,56.64 99.46,56.16 v99.46,56.13 | v102.36,16.51 102.36,22.86 99.57,25.65 99.57,37.61 v99.51,37.66
MOTOR2LIMB  (via drill 0.35)
  Top 0.254: PSOC4200L.62 100.41,15.83 101.32,16.74 v101.35,16.74 | 89.79,55.37 v90,55.37 89.18,54.56 89.18,45.83 89.26,45.75 89.26,36.04 88.93,35.72 v88.93,35.43
  Bottom 0.254: LIMITB2.2 91.06,55.37 v90,55.37 | v88.93,35.43 97.64,35.43 99.16,33.91 99.16,25.49 101.35,23.3 v101.35,16.74
MOTOR2POT  (via drill 0.35)
  Top 0.254: POT2.2 86.18,52.38 86.18,34.81 v86.43,34.56 | PSOC4200L.64 97.37,16.83 v97.53,16.99
  Bottom 0.254: v97.53,16.99 97.53,17.15 97.28,17.4 97.28,27.33 91.72,32.9 91.72,34.31 91.33,34.69 90.79,34.69 90.65,34.56 v86.43,34.56
MOTOR2PWM  (via drill 0.35)
  Top 0.254: PSOC4200L.63 99.26,16.33 100.33,17.4 v103.63,17.4 | v112.16,55.75 112.16,55.01 111.91,54.76 111.91,38.34 v112.28,37.98
  Bottom 0.254: PWM2.2 118.25,57.78 117.21,56.74 113.15,56.74 v112.16,55.75 | v103.63,17.4 106.3,20.07 106.3,30.48 112.28,36.46 v112.28,37.98
MOTOR3A1  (via drill 0.35)
  Top 0.254: PSOC4200L.4 90.13,30.21 v89.89,30.45 | v62.41,30.66 62.05,30.66 60.98,31.73 58.95,31.73 58.42,32.26 55.61,32.26 v53.83,34.04
  Top 0.305: SHIFT3.3 50.29,47.62 49.02,46.35 46.48,46.35 3_ENCD3V3.4
  Bottom 0.254: 3_ENCD3V3.4 53.83,39.01 v53.83,34.04 | v89.89,30.45 89.69,30.66 v62.41,30.66
MOTOR3A2  (via drill 0.35)
  Top 0.254: v52.83,34.67 53.53,34.67 53.68,34.82 60.16,34.82 v60.33,34.65 | v90.48,33.24 90.63,33.08 PSOC4200L.3
  Top 0.305: SHIFT3.4 50.44,47.12 49.21,45.9 44.4,45.9 3_ENCD3V3.3
  Bottom 0.254: 3_ENCD3V3.3 45.34,44.96 47.3,44.96 52.83,39.43 v52.83,34.67 | v60.33,34.65 60.58,34.9 60.6,34.9 60.85,35.15 78.64,35.15 80.31,33.49 90.22,33.49 v90.48,33.24
MOTOR3A3  (via drill 0.35)
  Top 0.254: v51.92,35.56 v60.33,35.56 | v91.06,34.04 91.13,33.96 PSOC4200L.2
  Top 0.305: SHIFT3.5 50.59,46.62 49.4,45.44 42.32,45.44 3_ENCD3V3.2
  Bottom 0.254: 3_ENCD3V3.2 43.2,44.55 47.14,44.55 51.92,39.76 v51.92,35.56 | v60.33,35.56 78.81,35.56 80.47,33.9 88.77,33.9 89.02,33.9 90.92,33.9 v91.06,34.04
MOTOR3B1
  Top 0.305: SHIFT3.8 58.47,47.62 60.45,49.61 67.36,49.61 3_ENCD5V.4
MOTOR3B2
  Top 0.305: SHIFT3.7 58.62,47.12 60.64,49.15 65.28,49.15 3_ENCD5V.3
MOTOR3B3
  Top 0.305: SHIFT3.6 58.77,46.62 60.83,48.69 63.2,48.69 3_ENCD5V.2
MOTOR3LIMA  (via drill 0.35)
  Top 0.254: v99.87,45.34 99.87,44.88 99.62,44.63 99.62,38.49 100.17,37.94 100.17,37.39 100.15,37.37 100.15,34.16 v98.3,32.31 | PSOC4200L.5 89.63,29.43 v89.48,29.58 | v91.79,29.59 95.63,29.59 v97,30.96
  Bottom 0.254: LIMITA3.2 104.78,46.23 100.71,46.23 99.87,45.39 v99.87,45.34 | v89.48,29.58 v91.78,29.58 v91.79,29.59 | v97,30.96 98.3,32.26 v98.3,32.31
MOTOR3LIMB  (via drill 0.35)
  Top 0.254: PSOC4200L.6 89.13,28.64 88.57,29.2 88.57,30.15 89.66,31.24 89.66,45.93 v89.84,46.1
  Bottom 0.254: LIMITB3.2 91.95,46.1 v89.84,46.1
MOTOR3POT
  Top 0.254: POT3.2 85.78,42.62 85.78,29.78 88.13,27.43 PSOC4200L.8
MOTOR3PWM  (via drill 0.35)
  Top 0.254: PSOC4200L.7 88.63,27.86 v88.41,28.08 | v112.57,45.47 112.32,45.22 112.32,39.22 v112.96,38.59 | v93.33,28.05 99.86,28.05 v100.23,27.69
  Bottom 0.254: PWM3.2 117.6,46.35 113.46,46.35 v112.57,45.47 | v88.41,28.08 93.3,28.08 v93.33,28.05 | v100.23,27.69 108.96,36.42 109.59,36.42 109.75,36.59 109.75,37.21 111.18,38.64 112.55,38.64 112.6,38.59 v112.96,38.59
MOTOR4A1  (via drill 0.35)
  Top 0.254: PSOC4200L.19 76.28,15.83 75.45,16.65 75.45,17.01 v75.44,17.02 | v50.93,33.91 50.93,33.34 51.83,32.44 51.83,22.21 56.26,17.79 67.14,17.79 v67.39,18.04
  Top 0.305: 4_ENCD3V3.4 45.21,37.21 46.23,36.2 49.15,36.2 50.42,37.47 SHIFT4.3
  Bottom 0.254: 4_ENCD3V3.4 46.74,35.94 48.9,35.94 v50.93,33.91 | v67.39,18.04 68.32,18.04 68.97,17.39 69.74,17.39 70.35,16.77 75.19,16.77 v75.44,17.02
MOTOR4A2  (via drill 0.35)
  Top 0.254: v49.78,33.91 51.41,32.28 51.41,25.89 51.43,25.88 51.43,21.98 56.03,17.38 v68.05,17.38 | PSOC4200L.18 80.06,16.33 79.9,16.49 v78.11,16.49
  Top 0.305: SHIFT4.4 50.57,36.97 49.34,35.74 44.4,35.74 4_ENCD3V3.3
  Bottom 0.254: 4_ENCD3V3.3 43.29,37.47 45.22,35.53 48.16,35.53 v49.78,33.91 51.71,31.98 | v68.05,17.38 68.45,16.98 69.45,16.98 70.07,16.36 75.71,16.36 75.84,16.49 v78.11,16.49
MOTOR4A3  (via drill 0.35)
  Top 0.254: PSOC4200L.9 87.63,26.29 v87.38,26.54 | v58.09,31.57 58.34,31.32 60.1,31.32 61.17,30.25 v61.53,30.25
  Top 0.305: SHIFT4.5 50.71,36.47 49.53,35.28 42.32,35.28 4_ENCD3V3.2
  Bottom 0.254: 4_ENCD3V3.2 42.55,35.05 47.5,35.05 v48.77,33.78 50.98,31.57 v58.09,31.57 | v61.53,30.25 61.78,30 80.05,30 83.12,26.92 87,26.92 v87.38,26.54
MOTOR4B1
  Top 0.305: SHIFT4.8 58.47,37.47 60.45,39.45 67.36,39.45 4_ENCD5V.4
MOTOR4B2
  Top 0.305: SHIFT4.7 58.62,36.97 60.64,38.99 65.28,38.99 4_ENCD5V.3
MOTOR4B3
  Top 0.305: SHIFT4.6 58.77,36.47 60.83,38.53 62.61,38.53 63.68,37.47 4_ENCD5V.2
MOTOR4LIMA  (via drill 0.35)
  Top 0.254: PSOC4200L.22 77.2,14.33 72.79,18.74 72.79,23.25 74.73,25.19 74.73,36.65 74.98,36.9 74.98,39.4 v74.3,40.08 | v106.17,39.9 LIMITA4.2
  Bottom 0.254: v74.3,40.08 92.72,40.08 93.2,40.56 105.51,40.56 v106.17,39.9
MOTOR4LIMB  (via drill 0.35)
  Top 0.254: PSOC4200L.23 77.13,13.83 72.38,18.58 72.38,23.42 74.32,25.36 74.32,36.81 74.57,37.07 74.57,38.71 v74.11,39.17 | v93.47,39.9 LIMITB4.2
  Bottom 0.254: v93.47,39.9 93.23,39.66 74.89,39.66 74.4,39.17 v74.11,39.17
MOTOR4POT4  (via drill 0.35)
  Top 0.254: PSOC4200L.25 76.98,12.83 71.57,18.24 71.57,23.76 73.51,25.7 73.51,36.07 v73.26,36.32
  Bottom 0.254: v73.26,36.32 73.61,36.68 74.19,36.68 74.68,37.17 74.68,38.1 75.41,38.84 79.4,38.84 POT4.2
MOTOR4PWM  (via drill 0.35)
  Top 0.254: PSOC4200L.24 77.05,13.33 71.98,18.41 71.98,23.59 73.91,25.53 v73.91,37.34
  Bottom 0.254: 117.73,38.61 PWM4.2 117.09,39.24 75.06,39.24 73.91,37.97 v73.91,37.34
N$1
  Top 0.305: R1.2 24V.C
N$4
  Top 0.305: R2.2 5V.C
N$7
  Top 0.305: R3.2 3.3V.C
N$10
  Top 0.305: R4.2 4.C
N$13
  Top 0.305: R5.2 5.C
N$17
  Top 0.305: R6.2 6.C
N$20
  Top 0.305: 8.41,34.42 R7.2 11.28,34.8 7.C
SEL_SW1
  Top 0.152: 104.52,10.33 104.62,10.33 | 109.73,4.19 FEEDBACK.8
  Top 0.254: PSOC4200L.51 104.52,10.33 | 104.62,10.33 105.87,10.33 108.71,7.49 108.71,5.21 109.73,4.19
SEL_SW2
  Top 0.254: PSOC4200L.52 106.66,10.83 FEEDBACK.7
SEL_SW3
  Top 0.152: 109.6,9.27 FEEDBACK.6
  Top 0.254: PSOC4200L.53 107.54,11.33 109.6,9.27
SEL_SW4
  Top 0.152: 110.74,11.83 FEEDBACK.5
  Top 0.254: PSOC4200L.54 110.74,11.83
SWD_CLK  (via drill 0.35)
  Top 0.254: 94.49,18.67 94.77,18.95 106.74,18.95 106.92,18.77 v107.92,18.77 | v110.6,18.74 111.07,18.74 111.32,18.99 115.7,18.99 116.53,19.81 SWD.2
  Top 0.305: 94.49,18.67 93.08,17.26 92.86,17.26 90.43,14.83 PSOC4200L.21
  Bottom 0.254: v107.92,18.77 109.64,18.77 109.67,18.74 v110.6,18.74
SWD_DATA  (via drill 0.35)
  Top 0.254: 94.2,19.35 107.11,19.35 v107.19,19.43 | v109.95,19.39 115.53,19.39 SWD.1
  Top 0.305: PSOC4200L.20 90.18,15.33 94.2,19.35
  Bottom 0.254: v107.19,19.43 109.91,19.43 v109.95,19.39
VCCD
  Top 0.254: C1.1 92.54,6.48 PSOC4200L.48
VREF
  Top 0.254: PSOC4200L.1 91.63,19.62 93.22,21.21 C6.2
XRES  (via drill 0.35)
  Top 0.254: PSOC4200L.47 91.13,6.48 v91.8,5.82
  Top 0.305: R12.2 45.57,15.01 C7.2 45.59,12.32 U$2.A2 U$2.A1
  Bottom 0.254: v91.8,5.82 87.12,1.14 46.86,1.14 U$2.A1

### Text on the board
tPlace: GND | 3.3V | 5V | GND
tDocu: R8...11 | D | C